# Altium project WLE5_1121.PrjPcb
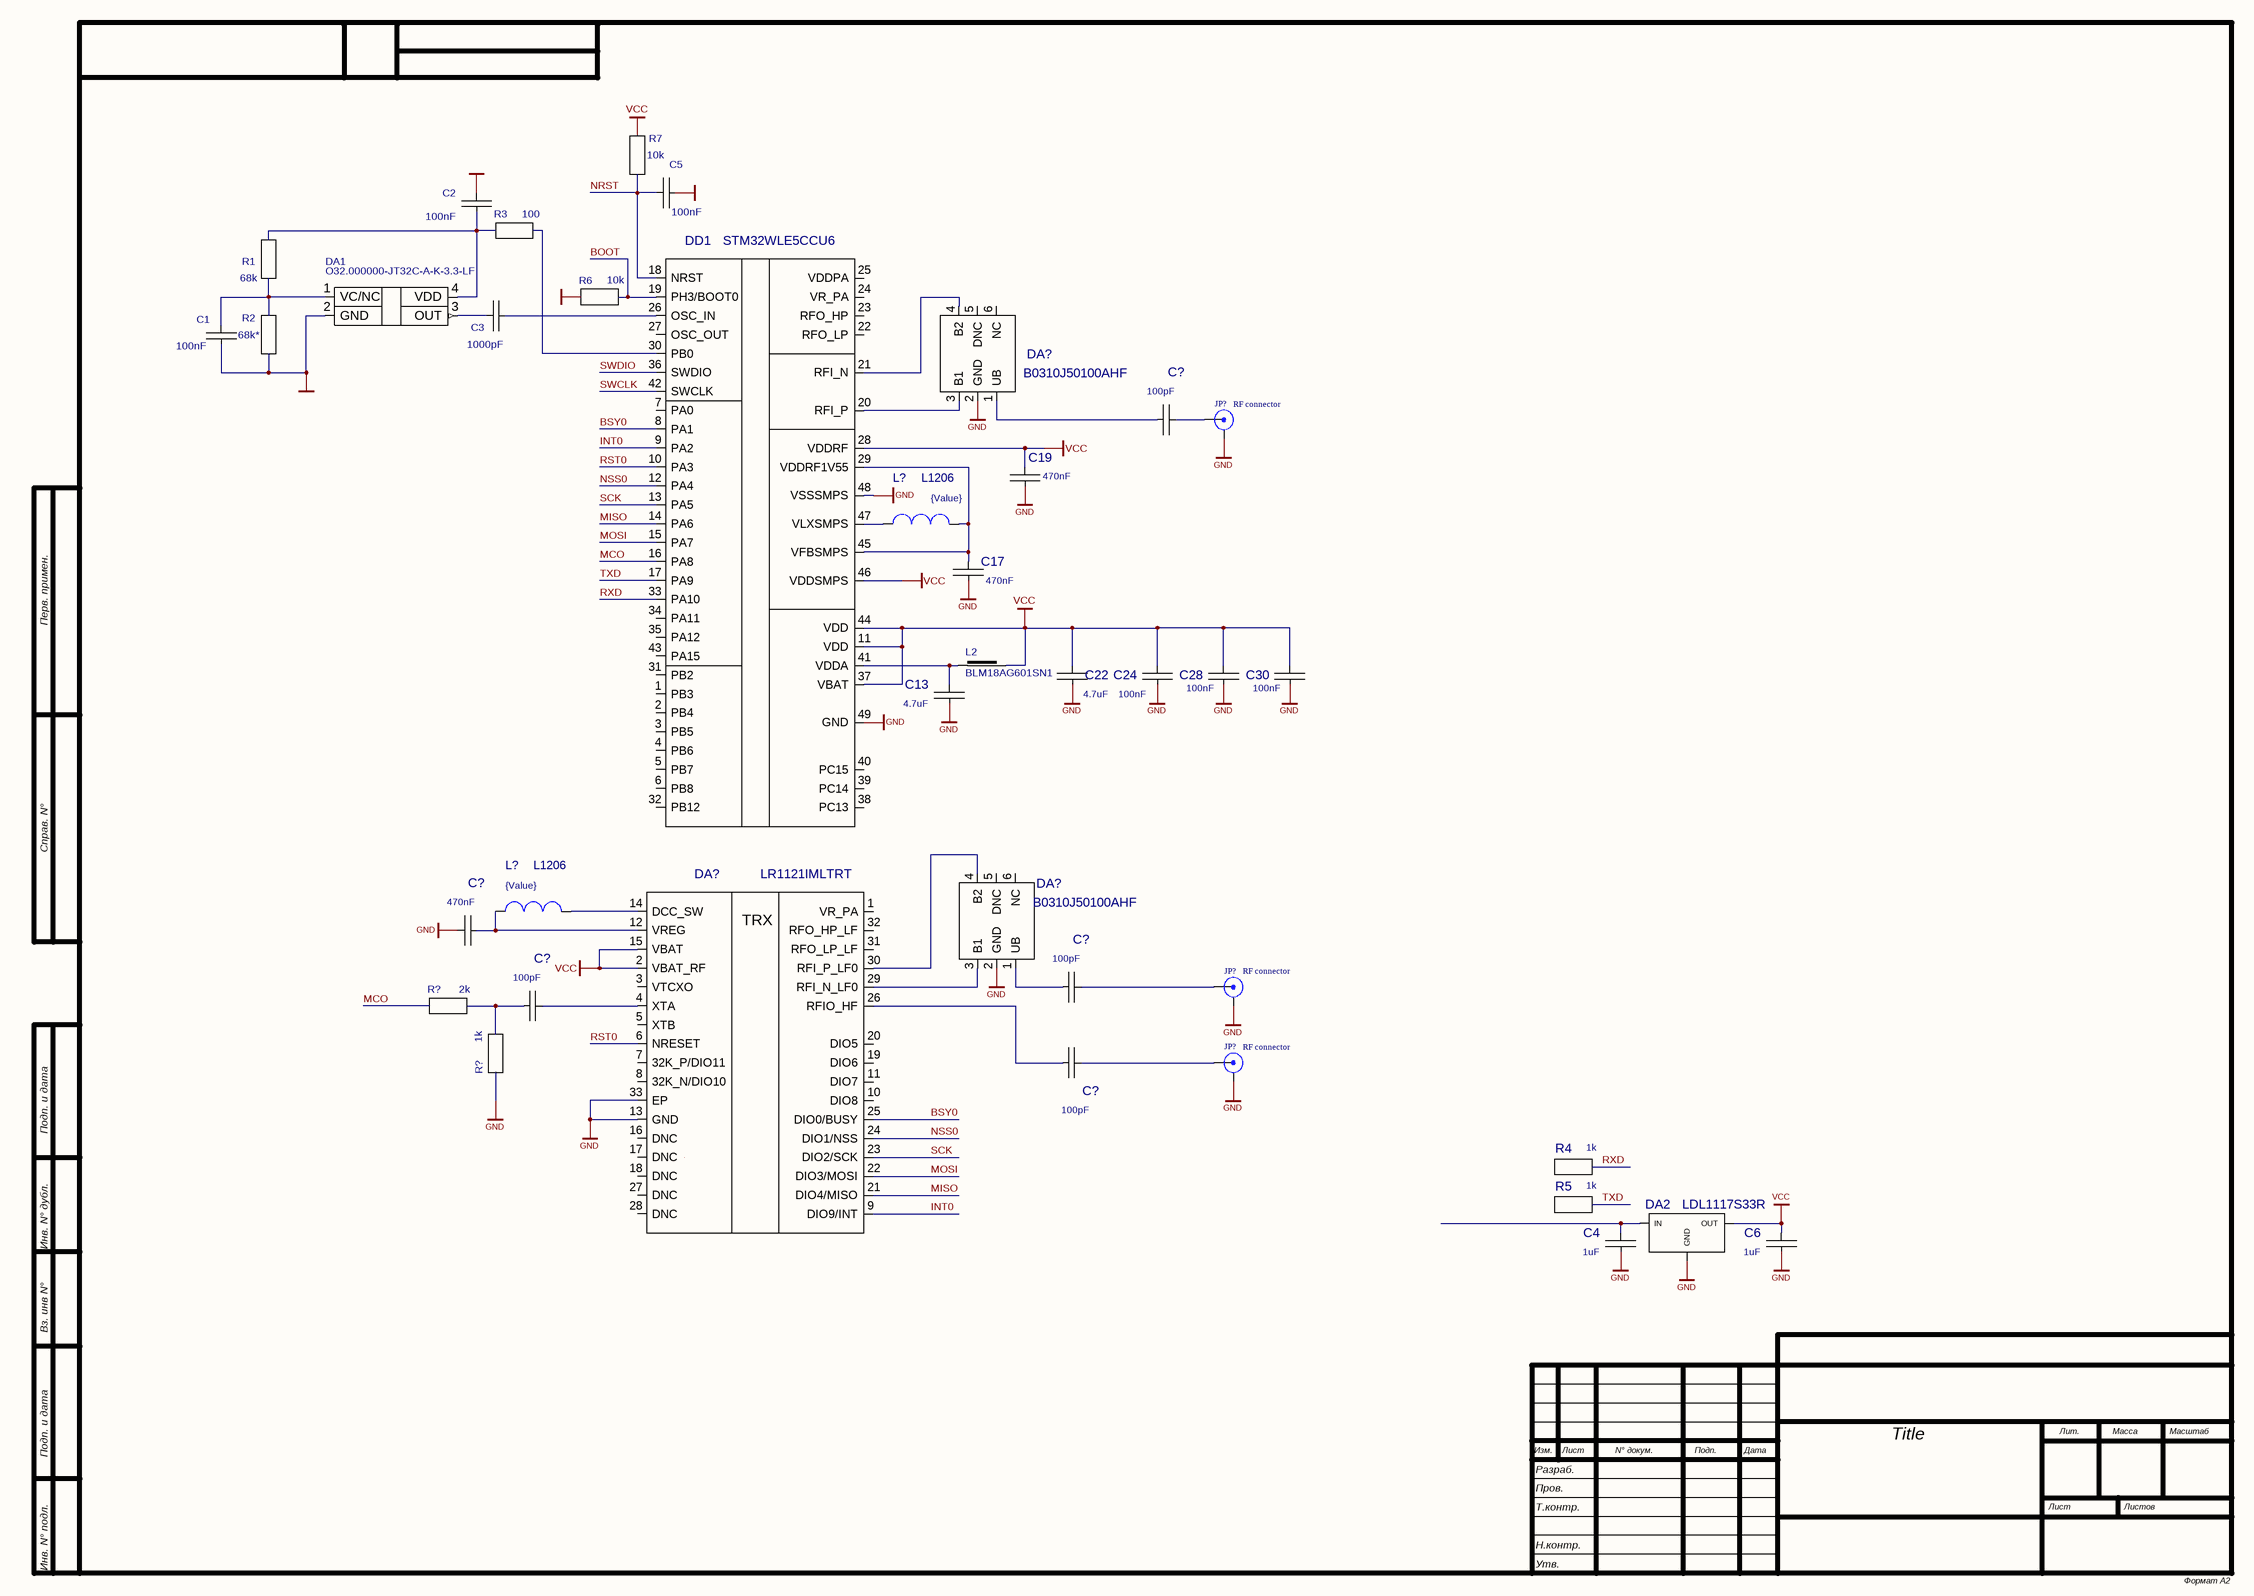
[diagram p0: WLE5_1121.SchDoc]
1 sheet, 39 parts. Net scope: global (net labels, ports and power ports of the same name join across sheets).
Board file: WLE5_1121.PcbDoc

## Sheet WLE5_1121.SchDoc
size 594 x 420 mm; SheetNumber: 1; SheetTotal: 1; DocumentName: Sheet1.SCHDOC

### Parts
(Parts that share a designator on the sheet are numbered #1, #2 ... from top to bottom, then left to right.)
C1  value 100nF  [C0402]  (hidden comment: C0402)
C2  value 100nF  [C0402]  (hidden comment: C0402)
C3  value 1000pF  [C0402]  (hidden comment: C0402)
C4  value 1uF  [C0805]  (hidden comment: C0805)
C5  value 100nF  [C0402]  (hidden comment: C0402)
C6  value 1uF  [C0805]  (hidden comment: C0805)
C13  value 4.7uF  [C0603]  (hidden comment: C0603)
C17  value 470nF  [C0603]  (hidden comment: C0603)
C19  value 470nF  [C0603]  (hidden comment: C0603)
C22  value 4.7uF  [C0603]  (hidden comment: C0603)
C24  value 100nF  [C0402]  (hidden comment: C0402)
C28  value 100nF  [C0402]  (hidden comment: C0402)
C30  value 100nF  [C0402]  (hidden comment: C0402)
C?#1  value 100pF  [C0402]  (hidden comment: C0402)
C?#2  value 470nF  [C0603]  (hidden comment: C0603)
C?#3  value 100pF  [C0402]  (hidden comment: C0402)
C?#4  value 100pF  [C0402]  (hidden comment: C0402)
C?#5  value 100pF  [C0402]  (hidden comment: C0402)
DA1  O32.000000-JT32C-A-K-3.3-LF  [ZQ_3.2_2.5]
DA2  LDL1117S33R  [SOT223]
DA?#1  B0310J50100AHF  [SON65P130X84-6N]
DA?#2  LR1121IMLTRT  [QFN32]
DA?#3  B0310J50100AHF  [SON65P130X84-6N]
DD1  STM32WLE5CCU6  [QFN48(7X7)]
JP?#1  RF connector  [AMPHENOL_132357-11]
JP?#2  RF connector  [AMPHENOL_132357-11]
JP?#3  RF connector  [AMPHENOL_132357-11]
L2  BLM18AG601SN1  [L0603]
L?#1  L1206  value {Value}  [R1206]
L?#2  L1206  value {Value}  [R1206]
R1  value 68k  [R0402]  (hidden comment: R0402)
R2  value 68k*  [R0402]  (hidden comment: R0402)
R3  value 100  [R0402]  (hidden comment: R0402)
R4  value 1k  [R0402]  (hidden comment: R0402)
R5  value 1k  [R0402]  (hidden comment: R0402)
R6  value 10k  [R0402]  (hidden comment: R0402)
R7  value 10k  [R0402]  (hidden comment: R0402)
R?#1  value 2k  [R0402]  (hidden comment: R0402)
R?#2  value 1k  [R0402]  (hidden comment: R0402)

### Nets
GND: C1.2 C2.1 C4.2 C5.2 C6.2 C13.2 C17.2 C19.2 C22.2 C24.2 C28.2 C30.2 C?#2.1 DA1.2(GND) DA2.1(GND) DA?#1.2(GND) DA?#2.13(GND) DA?#2.33(EP) DA?#3.2(GND) DD1.48(VSSSMPS) DD1.49(GND) JP?#1.2(Y) JP?#2.2(Y) JP?#3.2(Y) R2.2 R6.2 R?#2.2
VCC: C6.1 C19.1 C22.1 C24.1 C28.1 C30.1 DA2.2(OUT) DA?#2.2(VBAT_RF) DA?#2.15(VBAT) DD1.11(VDD) DD1.28(VDDRF) DD1.37(VBAT) DD1.44(VDD) DD1.46(VDDSMPS) L2.2 R7.2
BOOT: DD1.19(PH3/BOOT0) R6.1
BSY0: DA?#2.25(DIO0/BUSY) DD1.8(PA1)
INT0: DA?#2.9(DIO9/INT) DD1.9(PA2)
MCO: DD1.16(PA8) R?#1.2
MISO: DA?#2.21(DIO4/MISO) DD1.14(PA6)
MOSI: DA?#2.22(DIO3/MOSI) DD1.15(PA7)
NRST: C5.1 DD1.18(NRST) R7.1
NSS0: DA?#2.24(DIO1/NSS) DD1.12(PA4)
RST0: DA?#2.6(NRESET) DD1.10(PA3)
RXD: DD1.33(PA10) R4.2
SCK: DA?#2.23(DIO2/SCK) DD1.13(PA5)
SWCLK: DD1.42(SWCLK)
SWDIO: DD1.36(SWDIO)
TXD: DD1.17(PA9) R5.2
NetC1_1: C1.1 DA1.1(VC/NC) R1.2 R2.1
NetC2_2: C2.2 DA1.4(VDD) R1.1 R3.2
NetC3_1: C3.1 DA1.3(OUT)
NetC3_2: C3.2 DD1.26(OSC_IN)
NetC4_1: C4.1 DA2.3(IN)
NetC13_1: C13.1 DD1.41(VDDA) L2.1
NetC17_1: C17.1 DD1.29(VDDRF1V55) DD1.45(VFBSMPS) L?#1.2
NetC?#1_1: C?#1.1 JP?#1.1(X)
NetC?#1_2: C?#1.2 DA?#1.1(UB)
NetC?#2_2: C?#2.2 DA?#2.12(VREG) L?#2.1
NetC?#3_1: C?#3.1 JP?#2.1(X)
NetC?#3_2: C?#3.2 DA?#3.1(UB)
NetC?#4_1: C?#4.1 DA?#2.4(XTA)
NetC?#4_2: C?#4.2 R?#1.1 R?#2.1
NetC?#5_1: C?#5.1 JP?#3.1(X)
NetC?#5_2: C?#5.2 DA?#2.26(RFIO_HF)
NetDA?#1_3: DA?#1.3(B1) DD1.20(RFI_P)
NetDA?#1_4: DA?#1.4(B2) DD1.21(RFI_N)
NetDA?#2_14: DA?#2.14(DCC_SW) L?#2.2
NetDA?#2_29: DA?#2.29(RFI_N_LF0) DA?#3.3(B1)
NetDA?#2_30: DA?#2.30(RFI_P_LF0) DA?#3.4(B2)
NetDD1_30: DD1.30(PB0) R3.1
NetDD1_47: DD1.47(VLXSMPS) L?#1.1

Not connected (* = marked no-connect by the designer): DA2 4; DA?#1 5(DNC) 6(NC); DA?#2 1(VR_PA) 3(VTCXO) 5(XTB) 7(32K_P/DIO11) 8(32K_N/DIO10) 10(DIO8) 11(DIO7) 16(DNC) 17(DNC) 18(DNC) 19(DIO6) 20(DIO5) 27(DNC) 28(DNC) 31(RFO_LP_LF) 32(RFO_HP_LF); DA?#3 5(DNC) 6(NC); DD1 1(PB3) 2(PB4) 3(PB5) 4(PB6) 5(PB7) 6(PB8) 7(PA0) 22(RFO_LP) 23(RFO_HP) 24(VR_PA) 25(VDDPA) 27(OSC_OUT) 31(PB2) 32(PB12) 34(PA11) 35(PA12) 38(PC13) 39(PC14) 40(PC15) 43(PA15); R4 1; R5 1

### Notes on the sheet
- Title
- Перв. примен.
- Справ. N°
- Подп. и дата
- Инв. N° дубл.
- Вз. инв N°
- Изм.
- Разраб.
- Лист
- N° докум.
- Подп.
- Дата
- Лит.
- Масса
- Масштаб
- Пров.
- Т.контр.
- Листов
- Н.контр.
- Утв.
- Инв. N° подл.
- Формат А2
- (in symbol LR1121) TRX

### Library data of the parts
C1-C3 C5 C24 C28 C30 C?#1 C?#3-C?#5 = C0402: Mounting  Method: SMD
C4 C6 = C0805: Mounting  Method: SMD
C13 C17 C19 C22 C?#2 = C0603: Mounting  Method: SMD
DA1 = TCXO_3225: Mounting  Method: SMD; Value: O32.000000-JT32C-A-K-3.3-LF
DA2 = LDL1117S33R: Value: {Value}; Mounting  Method: SMD
DA?#1 DA?#3 = B0310J50100AHF: Value: {Value}; Mounting  Method: SMD
DA?#2 = LR1121: Value: {Value}; Mounting  Method: SMD
DD1 = STM32WLE5CCU6: Value: {Value}; Mounting  Method: SMD
JP?#1-JP?#3 = RF connector: Вид: Роз'єм; *: *
L2 = BEAD: Mounting  Method: SMD; Value: BLM18AG601SN1
L?#1 L?#2 = L1206: Mounting  Method: SMD
R1-R7 R?#1 R?#2 = R0402: Mounting  Method: SMD